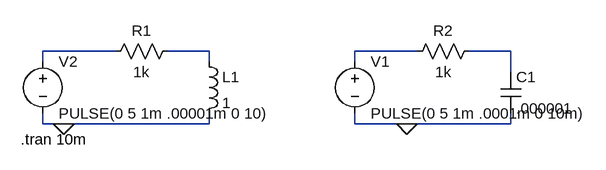
[diagram p0: schematic Caps vs Inductors.asc]
Caps vs Inductors.asc, the LTspice schematic file:
Version 4
SHEET 1 880 680
WIRE 16 96 -96 96
WIRE 160 96 96 96
WIRE 480 96 384 96
WIRE 624 96 560 96
WIRE -96 112 -96 96
WIRE 160 112 160 96
WIRE 384 112 384 96
WIRE 624 128 624 96
WIRE -96 208 -96 192
WIRE -64 208 -96 208
WIRE 160 208 160 192
WIRE 160 208 -64 208
WIRE 384 208 384 192
WIRE 464 208 384 208
WIRE 624 208 624 192
WIRE 624 208 464 208
FLAG -64 208 0
FLAG 464 208 0
SYMBOL res 112 80 R90
WINDOW 0 0 56 VBottom 2
WINDOW 3 32 56 VTop 2
SYMATTR InstName R1
SYMATTR Value 1k
SYMBOL ind 144 96 R0
SYMATTR InstName L1
SYMATTR Value 1
SYMBOL res 576 80 R90
WINDOW 0 0 56 VBottom 2
WINDOW 3 32 56 VTop 2
SYMATTR InstName R2
SYMATTR Value 1k
SYMBOL cap 608 128 R0
SYMATTR InstName C1
SYMATTR Value .000001
SYMBOL voltage 384 96 R0
WINDOW 123 0 0 Left 0
WINDOW 39 0 0 Left 0
SYMATTR InstName V1
SYMATTR Value PULSE(0 5 1m .0001m 0 10m)
SYMBOL voltage -96 96 R0
WINDOW 123 0 0 Left 0
WINDOW 39 0 0 Left 0
SYMATTR InstName V2
SYMATTR Value PULSE(0 5 1m .00001m 0 10)
TEXT -130 232 Left 2 !.tran 10m

The netlist it stands for:
* Caps vs Inductors.asc
R1 N002 N001 1k
L1 N002 0 1
R2 N004 N003 1k
C1 N004 0 .000001
V1 N003 0 PULSE(0 5 1m .0001m 0 10m)
V2 N001 0 PULSE(0 5 1m .00001m 0 10)
.tran 10m
.backanno
.end